# Altium schematic sheet RASPmini.SchDoc
size A4
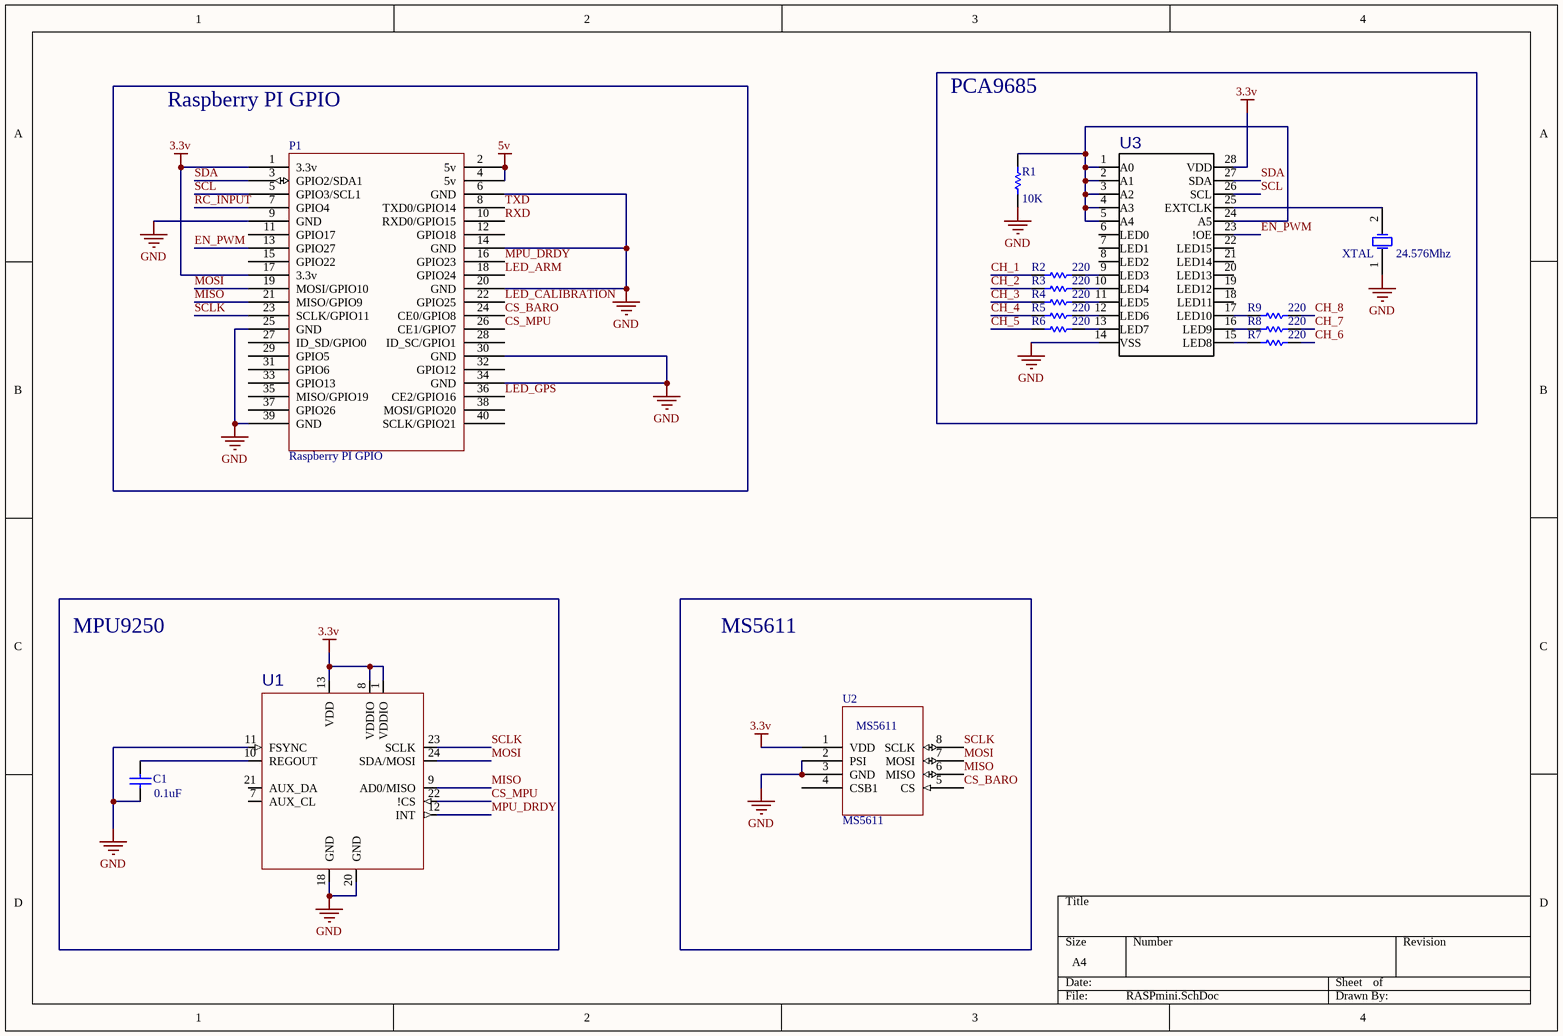
[diagram p0: RASPmini.SchDoc]

## Parts
24.576Mhz  XTAL  [R38]
C1  value 0.1uF  [RAD-0.3]  (hidden comment: Cap)
P1  Raspberry PI GPIO
R1  value 10K  [AXIAL-0.3]  (hidden comment: Res1)
R2  value 220  [AXIAL-0.3]  (hidden comment: Res1)
R3  value 220  [AXIAL-0.3]  (hidden comment: Res1)
R4  value 220  [AXIAL-0.3]  (hidden comment: Res1)
R5  value 220  [AXIAL-0.3]  (hidden comment: Res1)
R6  value 220  [AXIAL-0.3]  (hidden comment: Res1)
R7  value 220  [AXIAL-0.3]  (hidden comment: Res1)
R8  value 220  [AXIAL-0.3]  (hidden comment: Res1)
R9  value 220  [AXIAL-0.3]  (hidden comment: Res1)
U1  MPU-9250  [QFN-24/3MM]  (value not drawn)
U2  MS5611
U3  DRIVER-PCA9685PW(TSSOP28)  [TSSOP28-0.65-9.7X4.4MM]  (value not drawn)

## Nets
3.3v: P1.1(3.3v) P1.17(3.3v) U1.1(VDDIO) U1.8(VDDIO) U1.13(VDD) U2.1(VDD) U3.28(VDD)
5v: P1.2(5v) P1.4(5v)
GND: 24.576Mhz.1(OSC1) C1.1 P1.6(GND) P1.9(GND) P1.14(GND) P1.20(GND) P1.25(GND) P1.30(GND) P1.34(GND) P1.39(GND) R1.1 U1.11(FSYNC) U1.18(GND) U1.20(GND) U2.2(PSI) U2.3(GND) U3.14(VSS)
CH_1: R2.1
CH_2: R3.1
CH_3: R4.1
CH_4: R5.1
CH_5: R6.1
CH_6: R7.2
CH_7: R8.2
CH_8: R9.2
CS_BARO: P1.24(CE0/GPIO8) U2.5(CS)
CS_MPU: P1.26(CE1/GPIO7) U1.22(!CS)
EN_PWM: P1.13(GPIO27) U3.23(!OE)
LED_ARM: P1.18(GPIO24)
LED_CALIBRATION: P1.22(GPIO25)
LED_GPS: P1.36(CE2/GPIO16)
MISO: P1.21(MISO/GPIO9) U1.9(AD0/MISO) U2.6(MISO)
MOSI: P1.19(MOSI/GPIO10) U1.24(SDA/MOSI) U2.7(MOSI)
MPU_DRDY: P1.16(GPIO23) U1.12(INT)
RC_INPUT: P1.7(GPIO4)
RXD: P1.10(RXD0/GPIO15)
SCL: P1.5(GPIO3/SCL1) U3.26(SCL)
SCLK: P1.23(SCLK/GPIO11) U1.23(SCLK) U2.8(SCLK)
SDA: P1.3(GPIO2/SDA1) U3.27(SDA)
TXD: P1.8(TXD0/GPIO14)
Net24.576Mhz_2: 24.576Mhz.2(OSC2) U3.25(EXTCLK)
NetC1_2: C1.2 U1.10(REGOUT)
NetR1_2: R1.2 U3.1(A0) U3.2(A1) U3.3(A2) U3.4(A3) U3.5(A4) U3.24(A5)
NetR2_2: R2.2 U3.9(LED3)
NetR3_2: R3.2 U3.10(LED4)
NetR4_2: R4.2 U3.11(LED5)
NetR5_2: R5.2 U3.12(LED6)
NetR6_2: R6.2 U3.13(LED7)
NetR7_1: R7.1 U3.15(LED8)
NetR8_1: R8.1 U3.16(LED9)
NetR9_1: R9.1 U3.17(LED10)

Not connected (* = marked no-connect by the designer): P1 11(GPIO17) 12(GPIO18) 15(GPIO22) 27(ID_SD/GPIO0) 28(ID_SC/GPIO1) 29(GPIO5) 31(GPIO6) 32(GPIO12) 33(GPIO13) 35(MISO/GPIO19) 37(GPIO26) 38(MOSI/GPIO20) 40(SCLK/GPIO21); U1 7(AUX_CL) 21(AUX_DA); U2 4(CSB1); U3 6(LED0) 7(LED1) 8(LED2) 18(LED11) 19(LED12) 20(LED13) 21(LED14) 22(LED15)

## Notes on the sheet
- Raspberry PI GPIO
- PCA9685
- MPU9250
- MS5611

## Library data of the parts
24.576Mhz = XTAL: Crystal Oscillator; Published: 8-Jun-2000; LatestRevisionDate: 17-Jul-2002; LatestRevisionNote: Re-released for DXP Platform.; PackageReference: R38; Publisher: Altium Limited; PackageDescription: Crystal, Thru-Hole; 2 Leads; Body 3.1 x 8.2 mm (Dia.xH)
C1 = Cap: Capacitor; Published: 8-Jun-2000; LatestRevisionDate: 17-Jul-2002; LatestRevisionNote: Re-released for DXP Platform.; PackageReference: RAD-0.3; Publisher: Altium Limited; PackageDescription: Radial Cap, Thru-Hole; 2 Leads; 0.3 in Pin Spacing
R1-R9 = Res1: Resistor; Published: 8-Jun-2000; LatestRevisionDate: 17-Jul-2002; LatestRevisionNote: Re-released for DXP Platform.; PackageReference: AXIAL-0.3; Publisher: Altium Limited; PackageDescription: Axial Device, Thru-Hole; 2 Leads; 0.3 in Pin Spacing
U1 = MPU-9250: SMD Gyroscope/Accelerometer/Magnetometer Sensor; 9-AXIS; MF: InvenSense; Availability: Good; Price: 6.71 USD; MP: MPU-9250; Package: QFN-24 InvenSense; Value: *
U3 = DRIVER-PCA9685PW(TSSOP28): SMD IC LED DRVR, LIN DIM 25MA, 16 channels, 12bit; MF: NXP Semiconductors; Price: 1.95 USD; MP: PCA9685PW; Availability: Good; Package: TSSOP-28 NXP Semiconductors; Value: *